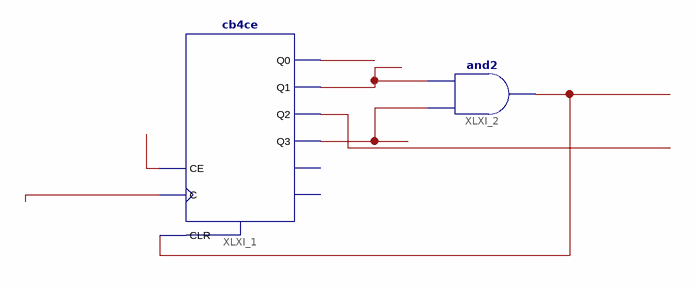
[diagram p0: schematic sheet 1]
// Xilinx ISE schematic count10.sch (spartan6) as structural Verilog: 2 symbols, 0 ports
module count10 (
);

  wire XLXN_1, XLXN_2, XLXN_3, XLXN_4, XLXN_5, XLXN_6, XLXN_7;

  cb4ce XLXI_1 (
    .C(XLXN_7), .CE(XLXN_6), .CLR(XLXN_5), .Q0(XLXN_1), .Q1(XLXN_2), .Q2(XLXN_3), .Q3(XLXN_4));  // open: CEO, TC
  and XLXI_2 (XLXN_5, XLXN_4, XLXN_2);
endmodule
